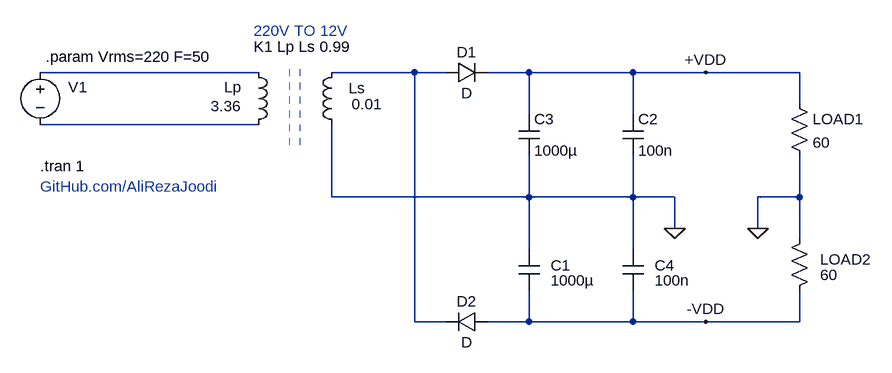
[diagram p0: schematic v1.0.asc]
v1.0.asc, the LTspice schematic file:
Version 4.1
SHEET 1 1736 680
WIRE -16 160 -352 160
WIRE 224 160 96 160
WIRE 272 160 224 160
WIRE 400 160 336 160
WIRE 560 160 400 160
WIRE 672 160 560 160
WIRE 816 160 672 160
WIRE 816 208 816 160
WIRE 400 224 400 160
WIRE 560 224 560 160
WIRE -16 240 -352 240
WIRE 96 352 96 240
WIRE 400 352 400 288
WIRE 400 352 96 352
WIRE 560 352 560 288
WIRE 560 352 400 352
WIRE 624 352 560 352
WIRE 816 352 816 288
WIRE 816 352 752 352
WIRE 624 400 624 352
WIRE 752 400 752 352
WIRE 816 416 816 352
WIRE 400 432 400 352
WIRE 560 432 560 352
WIRE 224 544 224 160
WIRE 272 544 224 544
WIRE 400 544 400 496
WIRE 400 544 336 544
WIRE 560 544 560 496
WIRE 560 544 400 544
WIRE 672 544 560 544
WIRE 816 544 816 496
WIRE 816 544 672 544
FLAG 624 400 0
FLAG 752 400 0
FLAG 672 160 +VDD
FLAG 672 544 -VDD
SYMBOL voltage -352 144 R0
WINDOW 0 43 39 Left 2
WINDOW 3 -248 72 Invisible 2
WINDOW 123 0 0 Left 0
WINDOW 39 -162 108 Left 2
SYMATTR InstName V1
SYMATTR Value SINE(0 {Vrms*1.414} {F})
SYMBOL diode 272 176 R270
WINDOW 0 32 32 VTop 2
WINDOW 3 0 32 VBottom 2
SYMATTR InstName D1
SYMBOL diode 336 528 R90
WINDOW 0 0 32 VBottom 2
WINDOW 3 32 32 VTop 2
SYMATTR InstName D2
SYMBOL cap 544 224 R0
SYMATTR InstName C2
SYMATTR Value 100n
SYMBOL cap 384 224 R0
SYMATTR InstName C3
SYMATTR Value 1000µ
SYMBOL ind -32 256 M180
WINDOW 0 -37 73 Left 2
WINDOW 3 -58 44 Left 2
SYMATTR InstName Lp
SYMATTR Value 3.36
SYMATTR Type ind
SYMATTR SpiceLine Ipk=0.2 Rser=82 Rpar=48k
SYMBOL ind 112 256 R180
WINDOW 0 -36 72 Left 2
WINDOW 3 -15 47 Right 2
SYMATTR InstName Ls
SYMATTR Value 0.01
SYMATTR Type ind
SYMATTR SpiceLine Ipk=3 Rser=0.6
SYMBOL cap 384 496 M180
WINDOW 0 49 39 Left 2
WINDOW 3 49 16 Left 2
SYMATTR InstName C1
SYMATTR Value 1000µ
SYMBOL cap 544 496 M180
WINDOW 0 49 39 Left 2
WINDOW 3 49 16 Left 2
SYMATTR InstName C4
SYMATTR Value 100n
SYMBOL res 800 192 R0
SYMATTR InstName LOAD1
SYMATTR Value 60
SYMBOL res 800 512 M180
WINDOW 0 48 64 Left 2
WINDOW 3 48 40 Left 2
SYMATTR InstName LOAD2
SYMATTR Value 60
TEXT -352 304 Left 2 !.tran 1
TEXT -24 120 Left 2 !K1 Lp Ls 0.99
TEXT -24 96 Left 2 ;220V TO 12V
TEXT -344 136 Left 2 !.param Vrms=220 F=50
TEXT -352 336 Left 2 ;GitHub.com/AliRezaJoodi
LINE Normal 32 272 32 144 2
LINE Normal 32 272 32 144 2
LINE Normal 48 272 48 144 2

The netlist it stands for:
* v1.0.asc
V1 N001 N003 SINE(0 {Vrms*1.414} {F})
D1 N002 +VDD D
D2 -VDD N002 D
C2 +VDD 0 100n
C3 +VDD 0 1000µ
Lp N003 N001 3.36 Ipk=0.2 Rser=82 Rpar=48k
Ls 0 N002 0.01 Ipk=3 Rser=0.6
C1 -VDD 0 1000µ
C4 -VDD 0 100n
R§LOAD1 +VDD 0 60
R§LOAD2 -VDD 0 60
.model D D
.lib standard.dio
.tran 1
K1 Lp Ls 0.99
* 220V TO 12V
.param Vrms=220 F=50
* GitHub.com/AliRezaJoodi
.backanno
.end